# Altium schematic sheet Art_Imp.SchDoc
size 420 x 297 mm; SheetNumber: 1; SheetTotal: 1
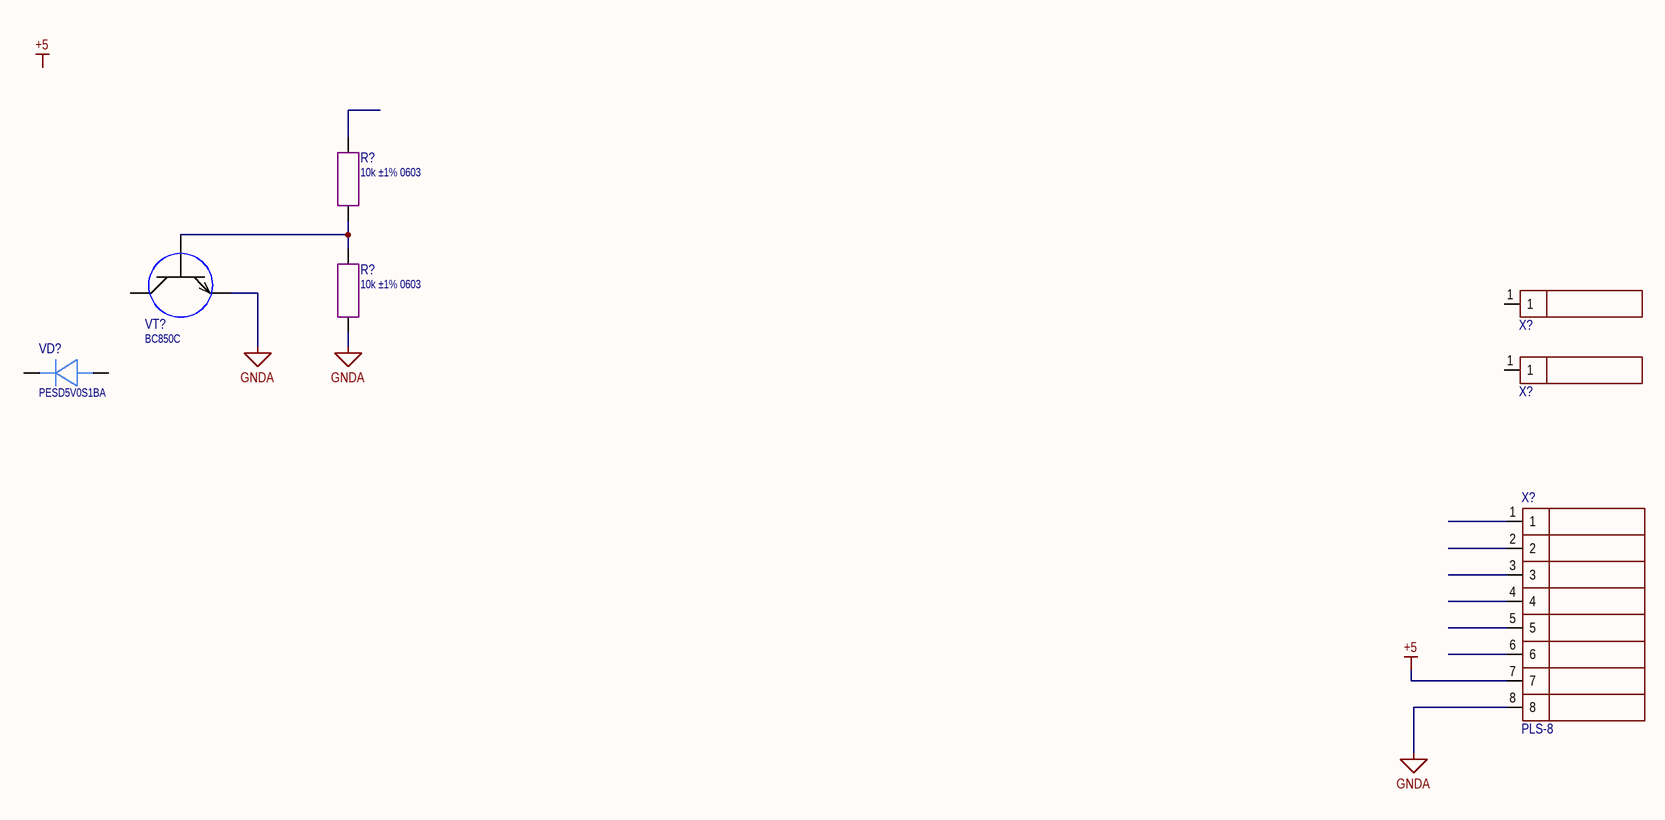
[diagram p0: Art_Imp.SchDoc]

## Parts
(Parts that share a designator on the sheet are numbered #1, #2 ... from top to bottom, then left to right.)
R?#1  10k ±1% 0603  [RES: SMD 0603 MD IPC 782]
R?#2  10k ±1% 0603  [RES: SMD 0603 MD IPC 782]
VD?  PESD5V0S1BA  [DIODE: SOD 323 MD IPC 782]
VT?  BC850C  [IC: SOT 23]
X?#1  1 pin  [CON: 1PIN]  (value not drawn)
X?#2  1 pin  [CON: 1PIN]  (value not drawn)
X?#3  PLS-8  [CON: 8PIN PLS-8]

## Nets
+5: X?#3.7
GNDA: R?#2.1 VT?.2 X?#3.8
NetR?#1_1: R?#1.1 R?#2.2 VT?.1

Not connected (* = marked no-connect by the designer): R?#1 2; VD? 1 2; VT? 3; X?#1 1; X?#2 1; X?#3 1 2 3 4 5 6

## Notes on the sheet
- Labels drawn without touching a wire or pin: +5
- Перв. примен.
- 3707.00000000 ЭИТ-1
- Справ. №
- Подп. и дата
- Инв. № дубл.
- Взам. инв. №
- Разраб.
- Изм.
- Лист
- № докум.
- Подп.
- Дата
- Лит.
- Масса
- Масштаб
- Пров.
- Т.контр.
- Листов
- Инв. № подл.
- Утв.
- Н.контр.
- 2.106-A3
- Копировал
- Формат А3

## Library data of the parts
R?#1 R?#2 = 10k ±1% 0603: Code: 6069191961; Name: Резистор 10K+-1% TK50 0603
VD? = Supressor 5V: Code: 6349981061; Name: Супрессор PESD5V0S1BA, 115
VT? = BJT NPN BC850C: Code: 6340001151; Name: Транзистор BC850C,215, Nexperia
X?#3 = 8 pin PLS 8